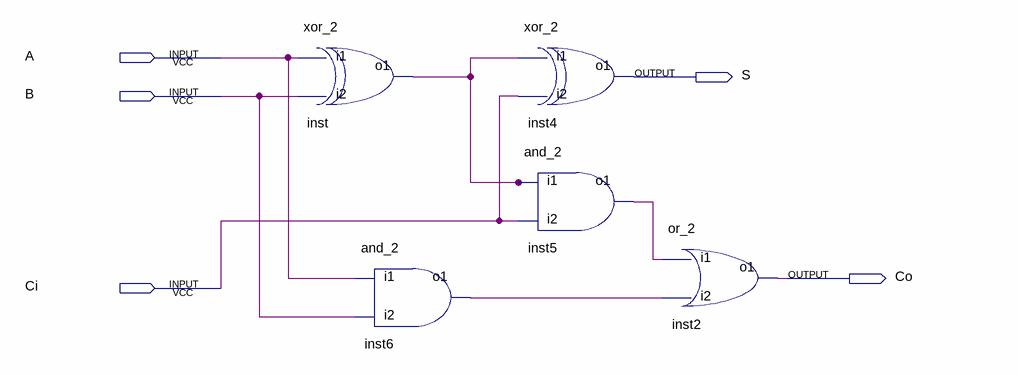
[diagram p0: schematic sheet]
// Quartus schematic FA1.bdf as structural Verilog: 5 symbols, 5 pins
module FA1 (
  input  A,
  input  B,
  input  Ci,
  output S,
  output Co
);

  wire inst5_o1, inst6_o1, inst_o1;

  xor_2 inst (.i1(A), .i2(B), .o1(inst_o1));
  and_2 inst6 (.i1(A), .i2(B), .o1(inst6_o1));
  xor_2 inst4 (.i1(inst_o1), .i2(Ci), .o1(S));
  and_2 inst5 (.i1(inst_o1), .i2(Ci), .o1(inst5_o1));
  or_2 inst2 (.i1(inst5_o1), .i2(inst6_o1), .o1(Co));
endmodule
